# Altium schematic sheet L6924D013TR.SchDoc
size A4; SheetNumber: 2; SheetTotal: 11
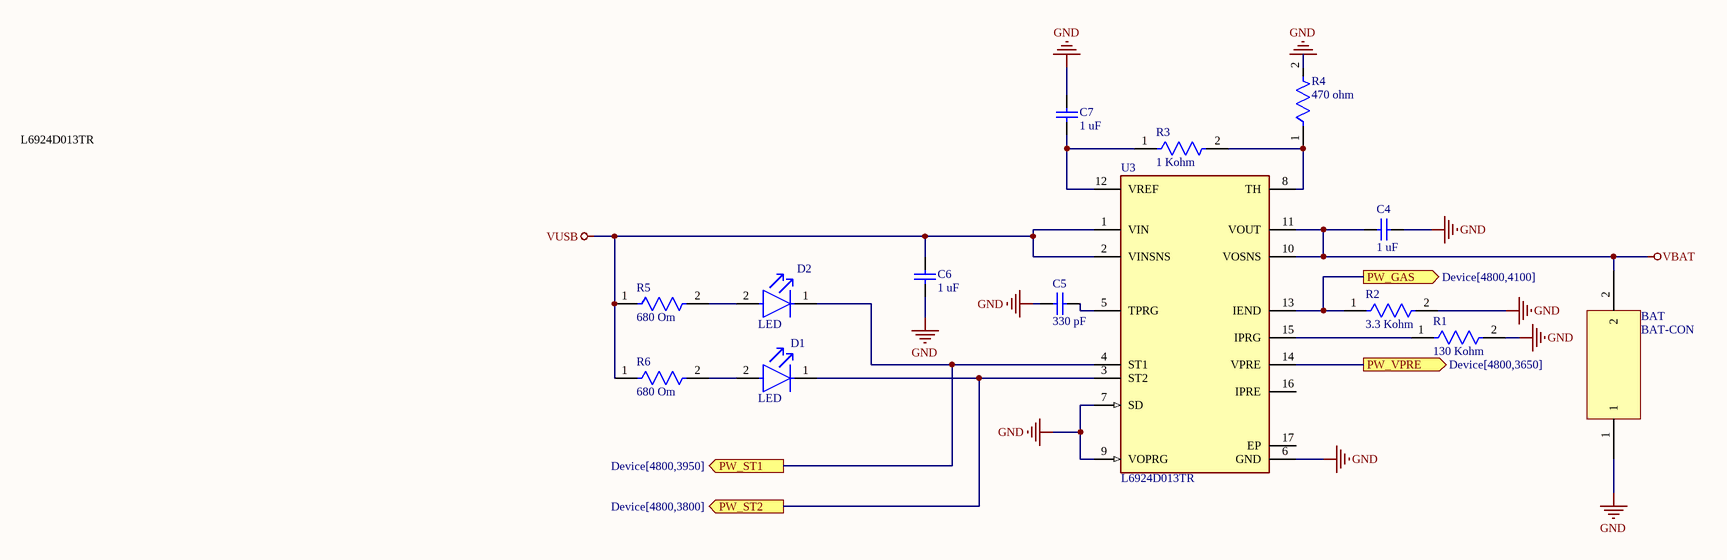
[diagram p0: L6924D013TR.SchDoc]

## Parts
BAT  BAT-CON  [BAT-CON]
C4  1 uF  [CAPC1005X55X25NL05T10]
C5  330 pF  [CAPC1005X55X25NL05T10]
C6  1 uF  [CAPC1005X55X25NL05T10]
C7  1 uF  [CAPC1005X55X25NL05T10]
D1  LED  [FP-SML-P11MTT86-MFG]
D2  LED  [FP-SML-P11MTT86-MFG]
R1  130 Kohm  [FP-RC1005-IPC_C]
R2  3.3 Kohm  [FP-RC1005-IPC_C]
R3  1 Kohm  [FP-RC1005-IPC_C]
R4  470 ohm  [FP-RC1005-IPC_C]
R5  680 Om  [FP-RC1005-IPC_C]
R6  680 Om  [FP-RC1005-IPC_C]
U3  L6924D013TR  [FP-VFQFPN16-7185330-MFG]

## Ports
PW_GAS (out, see Device[4800,4100]), PW_ST1 (out, see Device[4800,3950]), PW_ST2 (out, see Device[4800,3800]), PW_VPRE (out, see Device[4800,3650])

## Nets
GND: BAT.1 C4.1 C5.2 C6.2 C7.1 R1.2 R2.2 R4.2 U3.6(GND) U3.7(SD) U3.9(VOPRG)
VBAT: BAT.2 C4.2 U3.10(VOSNS) U3.11(VOUT)
VUSB: C6.1 R5.1 R6.1 U3.1(VIN) U3.2(VINSNS)
PW_GAS: R2.1 U3.13(IEND) ; port PW_GAS
PW_ST1: D2.1(C) U3.4(ST1) ; port PW_ST1
PW_ST2: D1.1(C) U3.3(ST2) ; port PW_ST2
PW_VPRE: U3.14(VPRE) ; port PW_VPRE
NetC5_1: C5.1 U3.5(TPRG)
NetC7_2: C7.2 R3.1 U3.12(VREF)
NetD1_2: D1.2(A) R6.2
NetD2_2: D2.2(A) R5.2
NetR1_1: R1.1 U3.15(IPRG)
NetR3_2: R3.2 R4.1 U3.8(TH)

Not connected (* = marked no-connect by the designer): U3 16(IPRE) 17(EP)

## Notes on the sheet
- L6924D013TR

## Library data of the parts
C4-C7 = CMP-2008-04515-1: Manufacturer: Murata; Part Number: GRM155F50J684ZE01D
D1 D2 = CMP-2000-07126-2: LED YELLOW/GREEN CLEAR 1006 SMD; Forward Current: 20mA; Lens Color: Colorless; Power Rating: 54mW; Lens Style: Diffused; Wavelength: 569nm; Viewing Angle: 150°; Number of LEDs: 1; Test Current: 1mA; Luminous Intensity: 2.1mcd; Illumination Color: Green; Forward Voltage: 1.9V; REACH SVHC: No SVHC; Mount: Surface Mount; Series: PicoLED™; Case Code (Imperial): 0402; Min Operating Temperature: -40°C; Max Operating Temperature: 85°C; Number of Pins: 2; Package Quantity: 1; Height: 0.25mm; Lens Transparency: Clear; Case Code (Metric): 1005; Packaging: Tape and Reel; Width: 0.6mm; Radiation Hardening: No; Case/Package: 0402; Lead Free: Lead Free; Color: Green; RoHS Compliant: Yes; Length: 1mm; Dominant Wavelength: 569nm
R1-R6 = CMP-13261-000953-1: Res Thick Film 0402 1.87kΩ 1% 0.063W ±100ppm/°C Molded SMD T/R; Power Rating: 63mW; Voltage Rating (DC): 50V; Resistance: 1.87kR; Tolerance: 1%; Height: 0.016inch; Length: 1mm; Case Code (Metric): 1005; Width: 0.02inch; Max Power Dissipation: 63mW; Radiation Hardening: No; Features: Moisture Resistant; Temperature Coefficient: 100ppm/°C; Min Operating Temperature: -55°C; Number of Terminations: 2; Max Operating Temperature: 155°C; Case Code (Imperial): 0402; Composition: Thick Film; Depth: 0.5mm; Lead Free: Lead Free; Package Quantity: 1; Case/Package: 0402; Packaging: Tape and Reel; Contact Plating: Tin; Military Standard: Not
U3 = CMP-12147-000005-1: IC BATT CHRGR ION/POLY 16-VFQFPN; Manufacturer: STMicroelectronics; Output Current: 975mA; Number Of Cells: 1; Standoff Height: 0.02mm; Max Junction Temp: +125°C; Max Supply Voltage: 12V; Nominal Supply Current: 1.8mA; Max Power Dissipation: 0.67W; Min Supply Voltage: 2.5V; Output Voltage: 4.2V; Automotive: No; Manufacturer Part Number: L6924D013TR; Digikey Description: IC BATT CHRGR ION/POLY 16-VFQFPN; ComponentLink2Description: Datasheet; Footprint Url: https://www.st.com/resource/en/datasheet/l6738.pdf; Device Class L2: Power Management ICs; Package: VFQFPN16-7185330; Temperature Range High: +125°C; Mouser Description: Battery Management Battery Charger Sys Li-Ion/Li-Poly; Number Of Outputs: 1; Lead Free: Yes; Device Class L3: Battery Management; Category: IC; Temperature: -40°C to +125°C; Temperature Range Low: -40°C; Octopart: https://octopart.com/l6924d013tr-stmicroelectronics-421996; ComponentLink2URL: https://www.st.com/resource/en/datasheet/l6924d.pdf; Device Class L1: Integrated Circuits (ICs); Height: 1mm; Ipc Land Pattern Name: QFN50P300X300X90-16; RoHS: TRUE